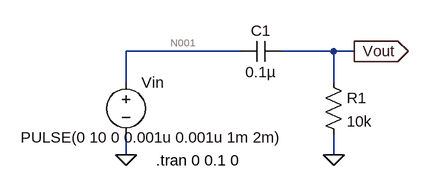
[diagram p0: schematic Draft1.asc]
Draft1.asc, the LTspice schematic file:
Version 4
SHEET 1 880 680
WIRE 128 112 -48 112
WIRE 272 112 192 112
WIRE 304 112 272 112
WIRE -48 160 -48 112
WIRE 272 160 272 112
WIRE -48 272 -48 240
WIRE 272 272 272 240
FLAG 304 112 Vout
IOPIN 304 112 Out
FLAG -48 272 0
FLAG 272 272 0
SYMBOL res 256 144 R0
SYMATTR InstName R1
SYMATTR Value 10k
SYMBOL cap 192 96 R90
WINDOW 0 0 32 VBottom 2
WINDOW 3 32 32 VTop 2
SYMATTR InstName C1
SYMATTR Value 0.1µ
SYMBOL voltage -48 144 R0
WINDOW 3 -162 101 Left 2
WINDOW 123 0 0 Left 0
WINDOW 39 0 0 Left 0
SYMATTR InstName Vin
SYMATTR Value PULSE(0 10 0 0.001u 0.001u 1m 2m)
TEXT -2 280 Left 2 !.tran 0 0.1 0

The netlist it stands for:
* Draft1.asc
R1 Vout 0 10k
C1 Vout N001 0.1µ
Vin N001 0 PULSE(0 10 0 0.001u 0.001u 1m 2m)
.tran 0 0.1 0
.backanno
.end

* Results of the author's LTspice run, read from the files saved beside the schematic
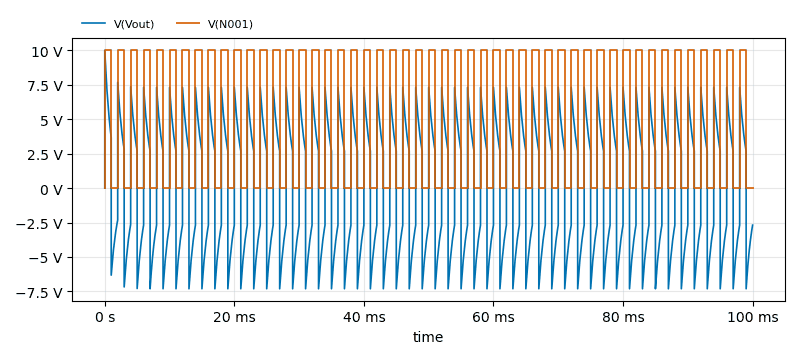
[diagram p1: Transient Analysis of Draft1.asc, plotted from the saved traces]
* Transient Analysis, 1 run:
*   V(Vout): min -7.312 V, max 10 V, average 27.65 mV, rms 4.902 V, last -2.688 V
*   V(N001): min 0 V, max 10 V, average 5 V, rms 7.071 V, last 0 V